# EAGLE schematic main (EAGLE 9.2.2)
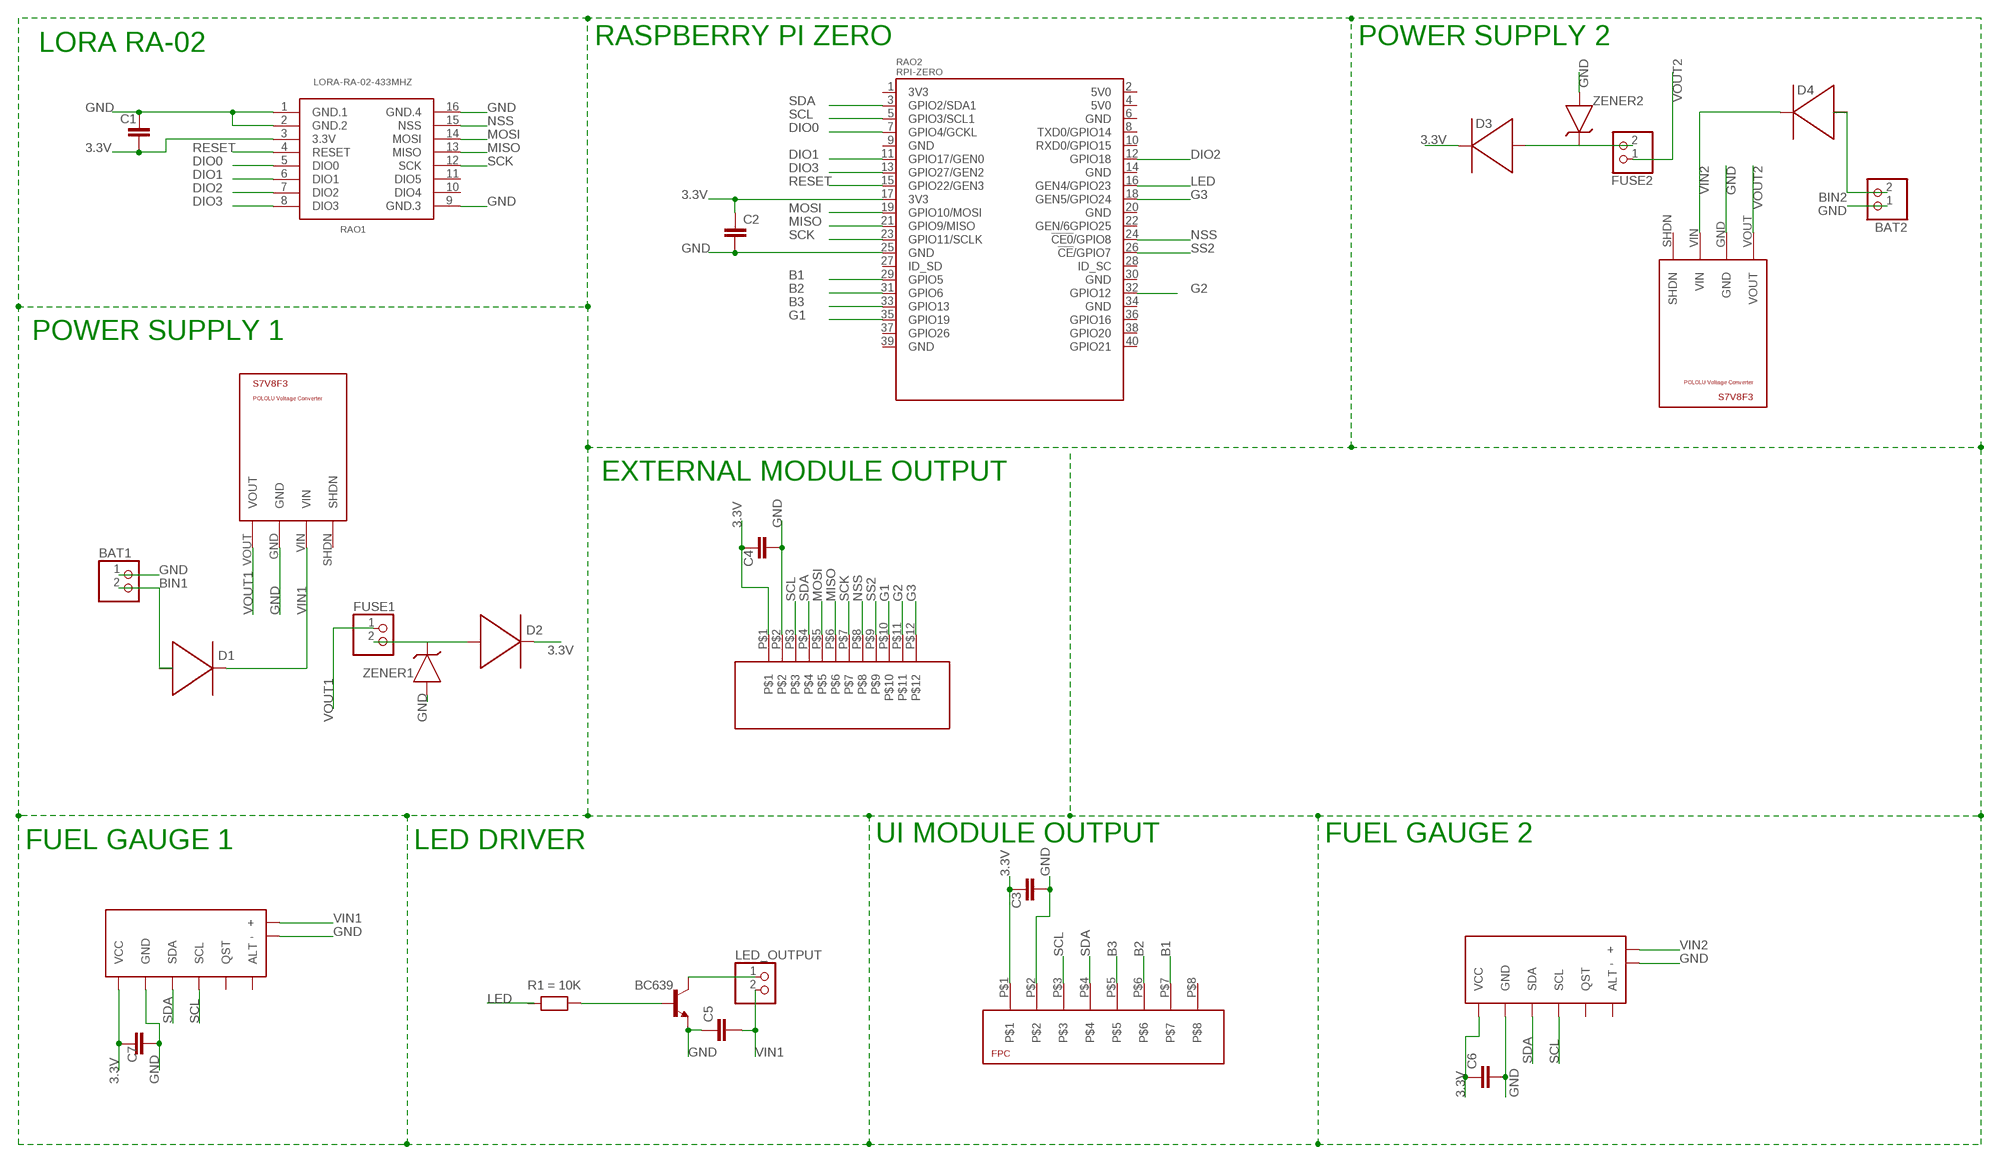
[diagram p0: schematic, sheet 1]

## Parts
BAT1  PINHD-1X2  [1X02]
BAT2  PINHD-1X2  [1X02]
BC639  BCX59SMD  [TO92-EBC]
C1  C-EUC0402  [C0402]
C2  C-EUC0402  [C0402]
C3  C-EUC0402  [C0402]
C4  C-EUC0402  [C0402]
C5  C-EUC0402  [C0402]
C6  C-EUC0402  [C0402]
C7  C-EUC0402  [C0402]
D1  DIODE1206  [1206]
FUSE1  PINHD-1X2  [1X02]
FUSE2  PINHD-1X2  [1X02]
LED_OUTPUT  PINHD-1X2  [1X02]
R1  RESISTOR1206  [1206]
RAO1  LORA-RA-02-433MHZ  [LORA-RA2-SMD]
RAO2  RPI-ZERO  [RASPBERRYPI_BASTELSTUBE_V13_RASPI_BOARD_B+_FULL]
RAO3  S7V8F3  [S7V8F3]
RAO4  S7V8F3  [S7V8F3]
U$1  TYCO_8PIN_1MM_SMD  [TYCO_1MM_8PIN]
U$2  TYCO_12PIN_1MM_SMD  [TYCO_1MM_12PIN]
U$3  POLOLU_FUEL_GAUGEBREAKBOARD  [BREAKBOARD]
U$4  DIODE1206  [1206]
U$5  SMD_COMPONENT1206  [1206]
U$6  SMD_COMPONENT1206  [1206]
U$7  DIODE1206  [1206]
U$8  DIODE1206  [1206]
U$9  POLOLU_FUEL_GAUGEBREAKBOARD  [BREAKBOARD]

## Nets
3.3V: C1.2 C2.1 C3.1 C4.1 C6.1 C7.1 RAO1.3(3.3V) RAO2.17(3V3) U$1.P$1 U$2.P$1 U$3.VCC U$4.P$2 U$7.P$2 U$9.VCC
B1: RAO2.29(GPIO5) U$1.P$7
B2: RAO2.31(GPIO6) U$1.P$6
B3: RAO2.33(GPIO13) U$1.P$5
BIN1: BAT1.2 D1.P$1
BIN2: BAT2.2 U$8.P$1
DIO0: RAO1.5(DIO0) RAO2.7(GPIO4/GCKL)
DIO1: RAO1.6(DIO1) RAO2.11(GPIO17/GEN0)
DIO2: RAO1.7(DIO2) RAO2.12(GPIO18)
DIO3: RAO1.8(DIO3) RAO2.13(GPIO27/GEN2)
G1: RAO2.35(GPIO19) U$2.P$10
G2: RAO2.32(GPIO12) U$2.P$11
G3: RAO2.18(GEN5/GPIO24) U$2.P$12
GND: BAT1.1 BAT2.1 BC639.E C1.1 C2.2 C3.2 C4.2 C5.1 C6.2 C7.2 RAO1.1(GND.1) RAO1.2(GND.2) RAO1.9(GND.3) RAO1.16(GND.4) RAO2.25(GND) RAO3.GND RAO4.GND U$1.P$2 U$2.P$2 U$3.- U$3.GND U$5.P$1 U$6.P$1 U$9.- U$9.GND
LED: R1.P$1 RAO2.16(GEN4/GPIO23)
MISO: RAO1.13(MISO) RAO2.21(GPIO9/MISO) U$2.P$6
MOSI: RAO1.14(MOSI) RAO2.19(GPIO10/MOSI) U$2.P$5
N$1: BC639.B R1.P$2
N$2: FUSE2.2 U$6.P$2 U$7.P$1
N$3: FUSE1.2 U$4.P$1 U$5.P$2
N$4: BC639.C LED_OUTPUT.1
NSS: RAO1.15(NSS) RAO2.24(!CE0!/GPIO8) U$2.P$8
RESET: RAO1.4(RESET) RAO2.15(GPIO22/GEN3)
SCK: RAO1.12(SCK) RAO2.23(GPIO11/SCLK) U$2.P$7
SCL: RAO2.5(GPIO3/SCL1) U$1.P$3 U$2.P$3 U$3.SCL U$9.SCL
SDA: RAO2.3(GPIO2/SDA1) U$1.P$4 U$2.P$4 U$3.SDA U$9.SDA
SS2: RAO2.26(!CE!/GPIO7) U$2.P$9
VIN1: C5.2 D1.P$2 LED_OUTPUT.2 RAO3.VIN U$3.+
VIN2: RAO4.VIN U$8.P$2 U$9.+
VOUT1: FUSE1.1 RAO3.VOUT
VOUT2: FUSE2.1 RAO4.VOUT
Unconnected: RAO1.10(DIO4) RAO1.11(DIO5) RAO2.1(3V3) RAO2.2(5V0) RAO2.4(5V0) RAO2.6(GND) RAO2.8(TXD0/GPIO14) RAO2.9(GND) RAO2.10(RXD0/GPIO15) RAO2.14(GND) RAO2.20(GND) RAO2.22(GEN/6GPIO25) RAO2.27(ID_SD) RAO2.28(ID_SC) RAO2.30(GND) RAO2.34(GND) RAO2.36(GPIO16) RAO2.37(GPIO26) RAO2.38(GPIO20) RAO2.39(GND) RAO2.40(GPIO21) RAO3.SHDN RAO4.SHDN U$1.P$8 U$3.ALT U$3.QST U$9.ALT U$9.QST

## Notes on the sheet
- LORA RA-02 | RASPBERRY PI ZERO | POWER SUPPLY 2
- POWER SUPPLY 1
- EXTERNAL MODULE OUTPUT
- FUEL GAUGE 1 | LED DRIVER | UI MODULE OUTPUT | FUEL GAUGE 2

## Library data of the parts
BAT1 BAT2 FUSE1 FUSE2 LED_OUTPUT = pinhead:PINHD-1X2: PIN HEADER
BC639 = transistor-npn:BCX59*: NPN Transistor
C1-C7 = rcl:C-EU: CAPACITOR, European symbol; SPICEPREFIX: C
D1 = UniversalSMD:DIODE; D1: 2A
R1 = UniversalSMD:RESISTOR; R1: 10K
RAO1 = LikeCircuit:LORA-RA-02-433MHZ: 433 MHz Lora Ra-02 Radio Transceiver Module based on SX1276 chip. Visit our more eagle PCB <https://www.likecircuit.com/>
RAO2 = RPI-Zero:RPI-ZERO
RAO3 RAO4 = POLOLU-VoltageConverter:S7V8F3
U$1 = FPCConnectors:TYCO_8PIN_1MM_SMD
U$2 = FPCConnectors:TYCO_12PIN_1MM_SMD
U$3 U$9 = SparFun-FuelGauge:POLOLU_FUEL_GAUGE
U$4 = UniversalSMD:DIODE; D2: 2A
U$5 U$6 = UniversalSMD:SMD_COMPONENT
U$7 = UniversalSMD:DIODE; D3: 2A
U$8 = UniversalSMD:DIODE; D4: 2A